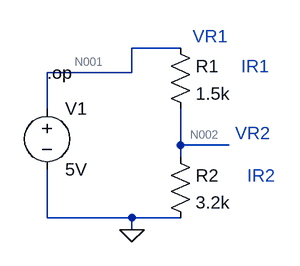
[diagram p0: schematic Draft1.asc]
Draft1.asc, the LTspice schematic file:
Version 4
SHEET 1 880 680
WIRE 224 80 160 80
WIRE 160 112 160 80
WIRE 160 112 48 112
WIRE 48 160 48 112
WIRE 224 208 224 160
WIRE 288 208 224 208
WIRE 224 224 224 208
WIRE 48 304 48 240
WIRE 160 304 48 304
WIRE 224 304 160 304
WIRE 160 320 160 304
FLAG 160 320 0
DATAFLAG 336 144 "round(I(R1)*100000)/100000"
DATAFLAG 336 288 "round(I(R2)*100000)/100000"
DATAFLAG 208 80 "round((V(n001)-V(n002))*100)/100"
DATAFLAG 256 208 "round($*100)/100"
SYMBOL voltage 48 144 R0
WINDOW 123 0 0 Left 0
WINDOW 39 0 0 Left 0
SYMATTR InstName V1
SYMATTR Value 5V
SYMBOL res 208 64 R0
SYMATTR InstName R1
SYMATTR Value 1.5k
SYMBOL res 208 208 R0
SYMATTR InstName R2
SYMATTR Value 3.2k
TEXT 48 112 Left 2 !.op
TEXT 304 104 Left 2 ;IR1
TEXT 312 248 Left 2 ;IR2
TEXT 240 64 Left 2 ;VR1
TEXT 296 192 Left 2 ;VR2

The netlist it stands for:
* Draft1.asc
V1 N001 0 5V
R1 N001 N002 1.5k
R2 N002 0 3.2k
.op
* IR1
* IR2
* VR1
* VR2
.backanno
.end

* Results of the author's LTspice run, read from the files saved beside the schematic
* Operating Point:
*   V(n001) = 5 V
*   V(n002) = 3.404 V
*   I(R2) = 1.064 mA
*   I(R1) = 1.064 mA
*   I(V1) = -1.064 mA